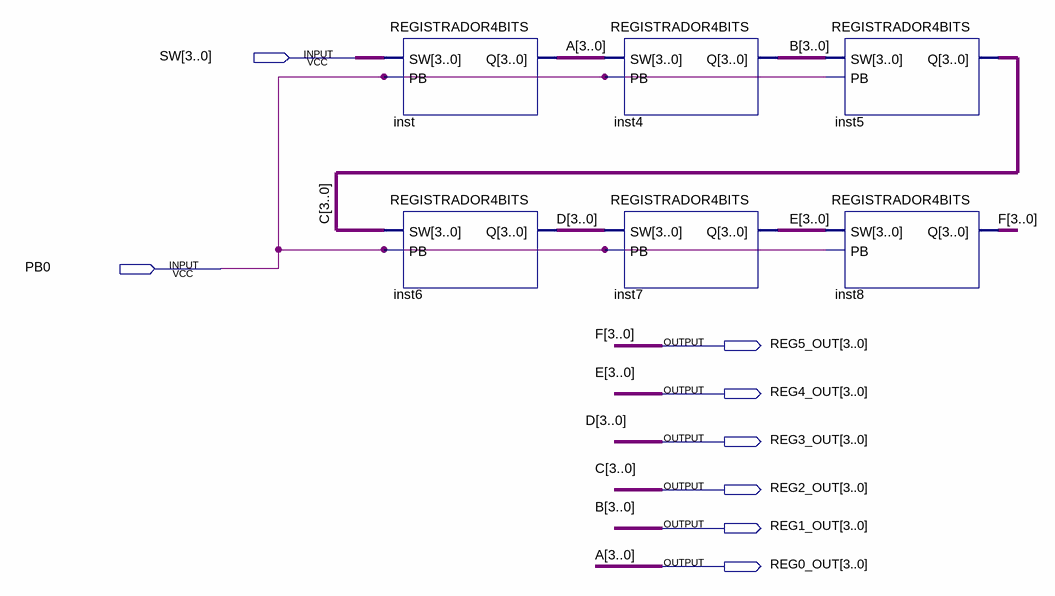
[diagram p0: schematic sheet]
// Quartus schematic DESLOCADOR.bdf as structural Verilog: 6 symbols, 8 pins
module DESLOCADOR (
  input  [3:0] SW,
  input  PB0,
  output [3:0] REG5_OUT,
  output [3:0] REG4_OUT,
  output [3:0] REG3_OUT,
  output [3:0] REG2_OUT,
  output [3:0] REG1_OUT,
  output [3:0] REG0_OUT
);

  REGISTRADOR4BITS inst (.SW(SW), .PB(PB0), .Q(REG0_OUT));
  REGISTRADOR4BITS inst6 (.SW(REG2_OUT), .PB(PB0), .Q(REG3_OUT));
  REGISTRADOR4BITS inst4 (.SW(REG0_OUT), .PB(PB0), .Q(REG1_OUT));
  REGISTRADOR4BITS inst7 (.SW(REG3_OUT), .PB(PB0), .Q(REG4_OUT));
  REGISTRADOR4BITS inst5 (.SW(REG1_OUT), .PB(PB0), .Q(REG2_OUT));
  REGISTRADOR4BITS inst8 (.SW(REG4_OUT), .PB(PB0), .Q(REG5_OUT));

  // Other names for the same wires on the sheet: A[3:0] = REG0_OUT; B[3:0] = REG1_OUT; C[3:0] = REG2_OUT;
  //   D[3:0] = REG3_OUT; E[3:0] = REG4_OUT; F[3:0] = REG5_OUT
endmodule
